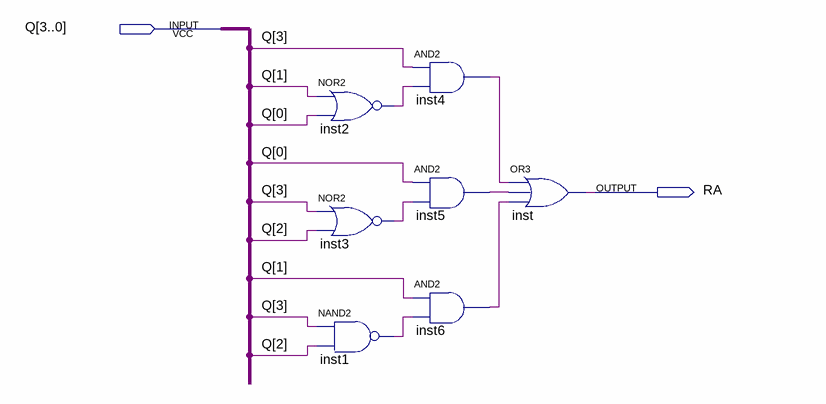
[diagram p0: schematic sheet]
// Quartus schematic RojoAbajo.bdf as structural Verilog: 7 symbols, 2 pins
module RojoAbajo (
  input  [3:0] Q,
  output RA
);

  wire inst1_out, inst2_out, inst3_out, inst4_out, inst5_out, inst6_out;

  nor inst2 (inst2_out, Q[1], Q[0]);
  nor inst3 (inst3_out, Q[3], Q[2]);
  nand inst1 (inst1_out, Q[3], Q[2]);
  and inst4 (inst4_out, Q[3], inst2_out);
  and inst5 (inst5_out, Q[0], inst3_out);
  and inst6 (inst6_out, Q[1], inst1_out);
  or inst (RA, inst4_out, inst5_out, inst6_out);
endmodule
